# EAGLE design 副机 插座 v0.1 (EAGLE 6.3)
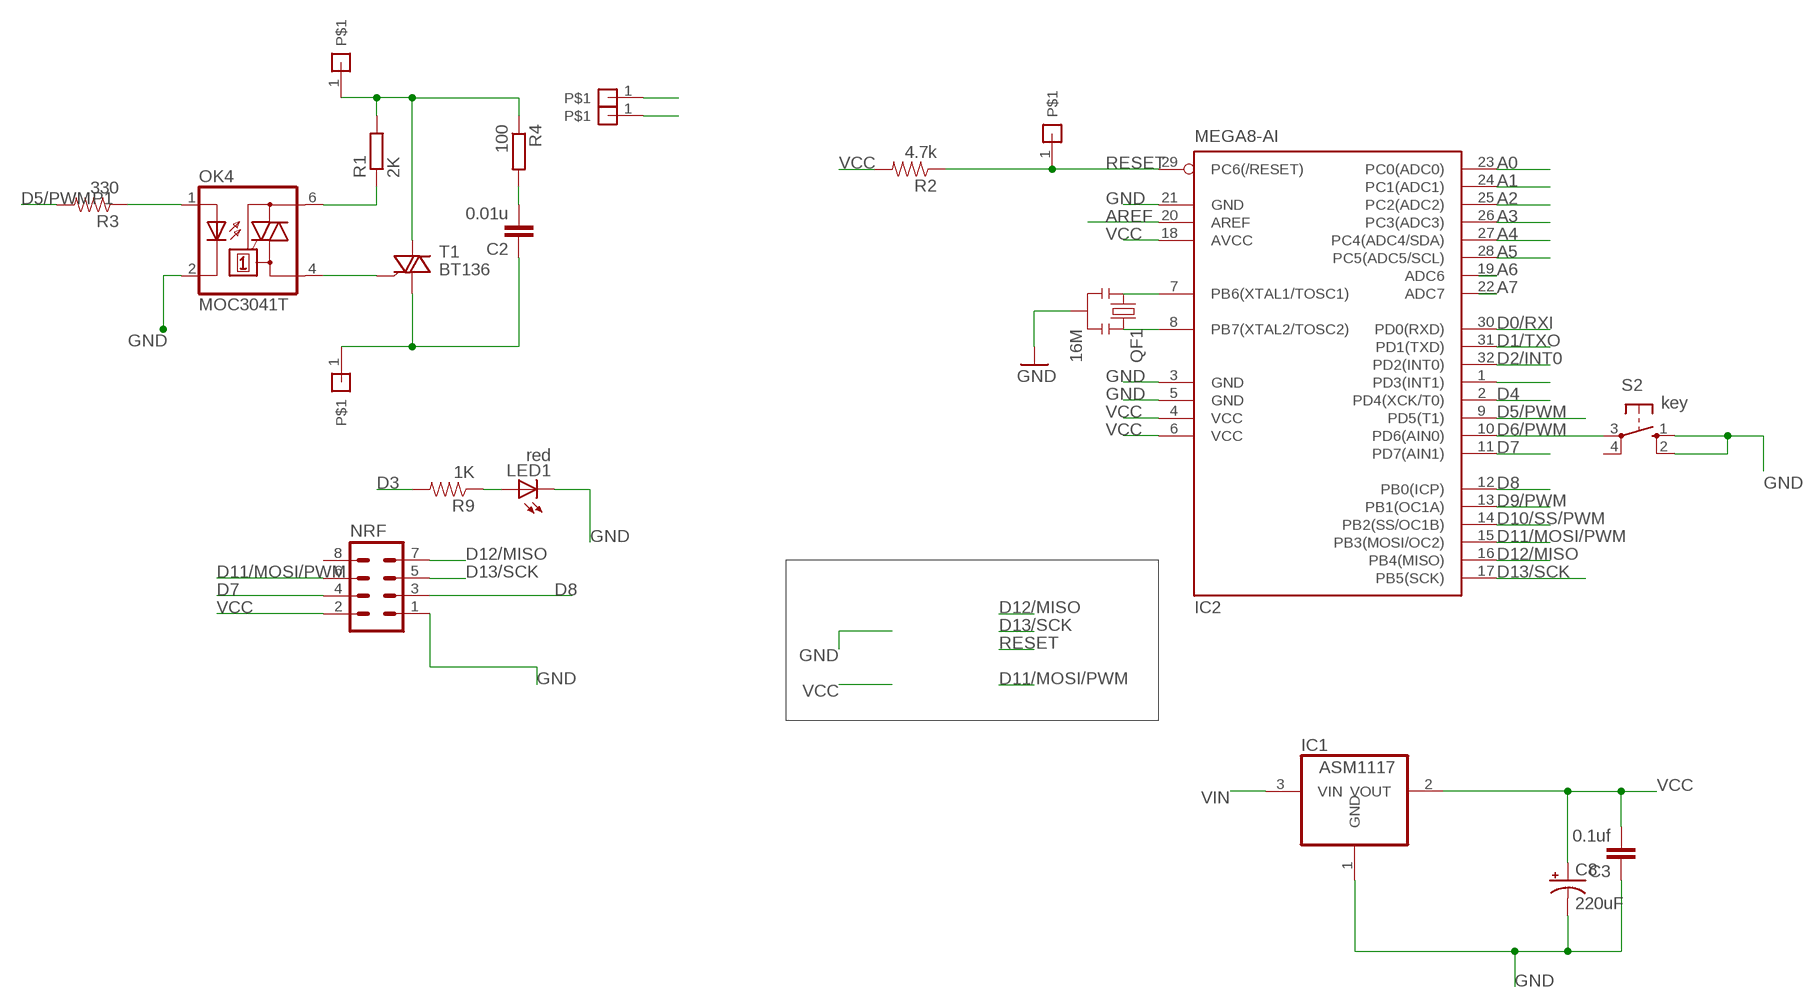
[diagram p0: schematic, sheet 1]

## Parts
C2  0.01u  C-EU050-024X044  [C050-024X044]
C3  0.1uf  CAP0603-CAP  [0603-CAP]
C8  220uF  CAP_POL3528  [EIA3528]
IC1  ASM1117  REG1117  [SOT223]
IC2  MEGA8-AI  [TQFP32-08]
LED1  red  LED3MM  [LED3MM]
NRF  MA04-2  [MA04-2]
OK4  MOC3041T  [DIL06B]
QF1  16M  RESONATORPTH  [RESONATOR-PTH]
R1  2K  R-EU_0204/7  [0204/7]
R2  4.7k  RESISTOR0603-RES  [0603-RES]
R3  330  RESISTOR0603-RES  [0603-RES]
R4  100  R-EU_0204/7  [0204/7]
R9  1K  RESISTOR0603-RES  [0603-RES]
S2  key  10-XX  [B3F-10XX]
T1  BT136  [TO220AB]
U$1  PIN1  [PIN1]
U$2  PIN1  [PIN1]
U$3  PIN1  [PIN1]
U$4  PIN1  [PIN1]
U$5  PIN1  [PIN1]

## Nets
A0: IC2.23(PC0(ADC0))
A1: IC2.24(PC1(ADC1))
A2: IC2.25(PC2(ADC2))
A3: IC2.26(PC3(ADC3))
A4: IC2.27(PC4(ADC4/SDA))
A5: IC2.28(PC5(ADC5/SCL))
A6: IC2.19(ADC6)
A7: IC2.22(ADC7)
AREF: IC2.20(AREF)
D0/RXI: IC2.30(PD0(RXD))
D1/TXO: IC2.31(PD1(TXD))
D2/INT0: IC2.32(PD2(INT0))
D3: IC2.1(PD3(INT1)) R9.2
D4: IC2.2(PD4(XCK/T0))
D5/PWM: IC2.9(PD5(T1)) R3.2
D6/PWM: IC2.10(PD6(AIN0)) S2.3(P)
D7: IC2.11(PD7(AIN1)) NRF.4
D8: IC2.12(PB0(ICP)) NRF.3
D9/PWM: IC2.13(PB1(OC1A))
D10/SS/PWM: IC2.14(PB2(SS/OC1B))
D11/MOSI/PWM: IC2.15(PB3(MOSI/OC2)) NRF.6
D12/MISO: IC2.16(PB4(MISO)) NRF.7
D13/SCK: IC2.17(PB5(SCK)) NRF.5
GND: C3.1 C8.C(-) IC1.1(GND) IC2.3(GND) IC2.5(GND) IC2.21(GND) LED1.K(C) NRF.1 OK4.2(C) QF1.2 S2.1(S) S2.2(S1) U$4.1
IN: R1.2 R4.1 T1.2(A2) U$2.1
N$1: OK4.6(A2) R1.1
N$2: OK4.4(A1) T1.3(G)
N$6: C2.2 R4.2
N$15: LED1.A R9.1
OUT: C2.1 T1.1(A1) U$1.1
P1: OK4.1(A) R3.1
PB6: IC2.7(PB6(XTAL1/TOSC1)) QF1.1
PB7: IC2.8(PB7(XTAL2/TOSC2)) QF1.3
RESET: IC2.29(PC6(/RESET)) R2.1 U$5.1
VCC: C3.2 C8.A(+) IC1.2(VOUT) IC2.4(VCC) IC2.6(VCC) IC2.18(AVCC) NRF.2 R2.2
VIN: IC1.3(VIN) U$3.1
Unconnected: NRF.8 S2.4(P1)

## Library data of the parts
C2 = resistor:C-EU: CAPACITOR, European symbol
C3 = MY:CAP: Capacitor Standard 0603 ceramic capacitor, and 0.1" leaded capacitor.
C8 = MY:CAP_POL: Capacitor Polarized These are standard SMD and PTH capacitors. Normally 10uF, 47uF, and 100uF in electrolytic and tantalum varieties. Always verify the external diameter of the through hole cap, it varies with capacity, voltage, and manufacturer. The EIA devices should be standard.
IC1 = burr-brown:REG1117: 800mA and 1A Low Dropout (LDO) Positive Regulator 1.8V, 2.5V, 2.85V, 3.3V, 5V, and Adj; MPN: REG1117; OC_FARNELL: 1097566; OC_NEWARK: 14P6981
IC2 = atmel:MEGA8: MICROCONTROLLER 8 Kbytes FLASH, 1 kbytes SRAM, 512 bytes EEPROM, USART, 6-channel 10 bit ADC, 2-channel 8 bit ADC Pin compatible with Atmega48, ATMega88, ATMega168 Source: avr.lbr; MPN: ATMEGA8-16AU; OC_FARNELL: 9171371; OC_NEWARK: 73M8863
LED1 = led:LED: LED OSRAM: - CHIPLED LG R971, LG N971, LY N971, LG Q971, LY Q971, LO R971, LY R971 LH N974, LH R974 LS Q976, LO Q976, LY Q976 LO Q996 - Hyper CHIPLED LW Q18S LB Q993, LB Q99A, LB R99A - SideLED LS A670, LO A670, LY A670, LG A670, LP A670 LB A673, LV A673, LT A673, LW A673 LH A674 LY A675 LS A676, LA A676, LO A676, LY A676, LW A676 LS A679, LY A679, LG A679 - Hyper Micro SIDELED® LS Y876, LA Y876, LO Y876, LY Y876 LT Y87S - SmartLED LW L88C, LW L88S LB L89C, LB L89S, LG L890 LS L89K, LO L89K, LY L89K LS L896, LA L896, LO L896, LY L896 - TOPLED LS T670, LO T670, LY T670, LG T670, LP T670 LSG T670, LSP T670, LSY T670, LOP T670, LYG T670 LG T671, LOG T671, LSG T671 LB T673, LV T673, LT T673, LW T673 LH T674 LS T676, LA T676, LO T676, LY T676, LB T676, LH T676, LSB T676, LW T676 LB T67C, LV T67C, LT T67C, LS T67K, LO T67K, LY T67K, LW E67C LS E67B, LA E67B, LO E67B, LY E67B, LB E67C, LV E67C, LT E67C LW T67C LS T679, LY T679, LG T679 LS T770, LO T770, LY T770, LG T770, LP T770 LB T773, LV T773, LT T773, LW T773 LH T774 LS E675, LA E675, LY E675, LS T675 LS T776, LA T776, LO T776, LY T776, LB T776 LHGB T686 LT T68C, LB T68C - Hyper Mini TOPLED® LB M676 - Mini TOPLED Santana® LG M470 LS M47K, LO M47K, LY M47K Source: http://www.osram.convergy.de LUXEON: - LUMILED® LXK2-PW12-R00, LXK2-PW12-S00, LXK2-PW14-U00, LXK2-PW14-V00 LXK2-PM12-R00, LXK2-PM12-S00, LXK2-PM14-U00 LXK2-PE12-Q00, LXK2-PE12-R00, LXK2-PE12-S00, LXK2-PE14-T00, LXK2-PE14-U00 LXK2-PB12-K00, LXK2-PB12-L00, LXK2-PB12-M00, LXK2-PB14-N00, LXK2-PB14-P00, LXK2-PB14-Q00 LXK2-PR12-L00, LXK2-PR12-M00, LXK2-PR14-Q00, LXK2-PR14-R00 LXK2-PD12-Q00, LXK2-PD12-R00, LXK2-PD12-S00 LXK2-PH12-R00, LXK2-PH12-S00 LXK2-PL12-P00, LXK2-PL12-Q00, LXK2-PL12-R00 Source: www.luxeon.com KINGBRIGHT: KA-3528ASYC Source: www.kingbright.com
NRF = con-lstb:MA04-2: PIN HEADER; OC_FARNELL: unknown; OC_NEWARK: unknown
OK4 = optocoupler:MOC30*: 6-Pin DIP Zero-Cross Optoisolators Triac Driver Output (250/400 Volt Peak) Source: http://www.fairchildsemi.com/ds/MO/MOC3043-M.pdf; OC_FARNELL: unknown; OC_NEWARK: unknown
QF1 = MY:RESONATOR: Resonator Small SMD resonator. This is the itty bitty 10/20MHz resonators with built in caps. CSTCE10M0G55 and CSTCE20M0V53. Footprint has been reviewed closely but hasn't been tested yet.
R1 R4 = resistor:R-EU_: RESISTOR, European symbol
R2 R3 R9 = MY:RESISTOR: Resistor Basic schematic elements and footprints for 0603, 1206, and PTH 1/10th watt (small) resistors.
S2 = switch-omron:10-XX: OMRON SWITCH; MPN: B3F-1000; OC_FARNELL: 176432; OC_NEWARK: 36M3542
T1 = triac:BT136: Triac BT136 series E sensitive gate Source: http://www.nxp.com/acrobat_download/datasheets/BT136_SERIES_E_2.pdf
U$1-U$5 = PKJ:PIN1

## Net classes
1 power: width 0.381 mm

## Board
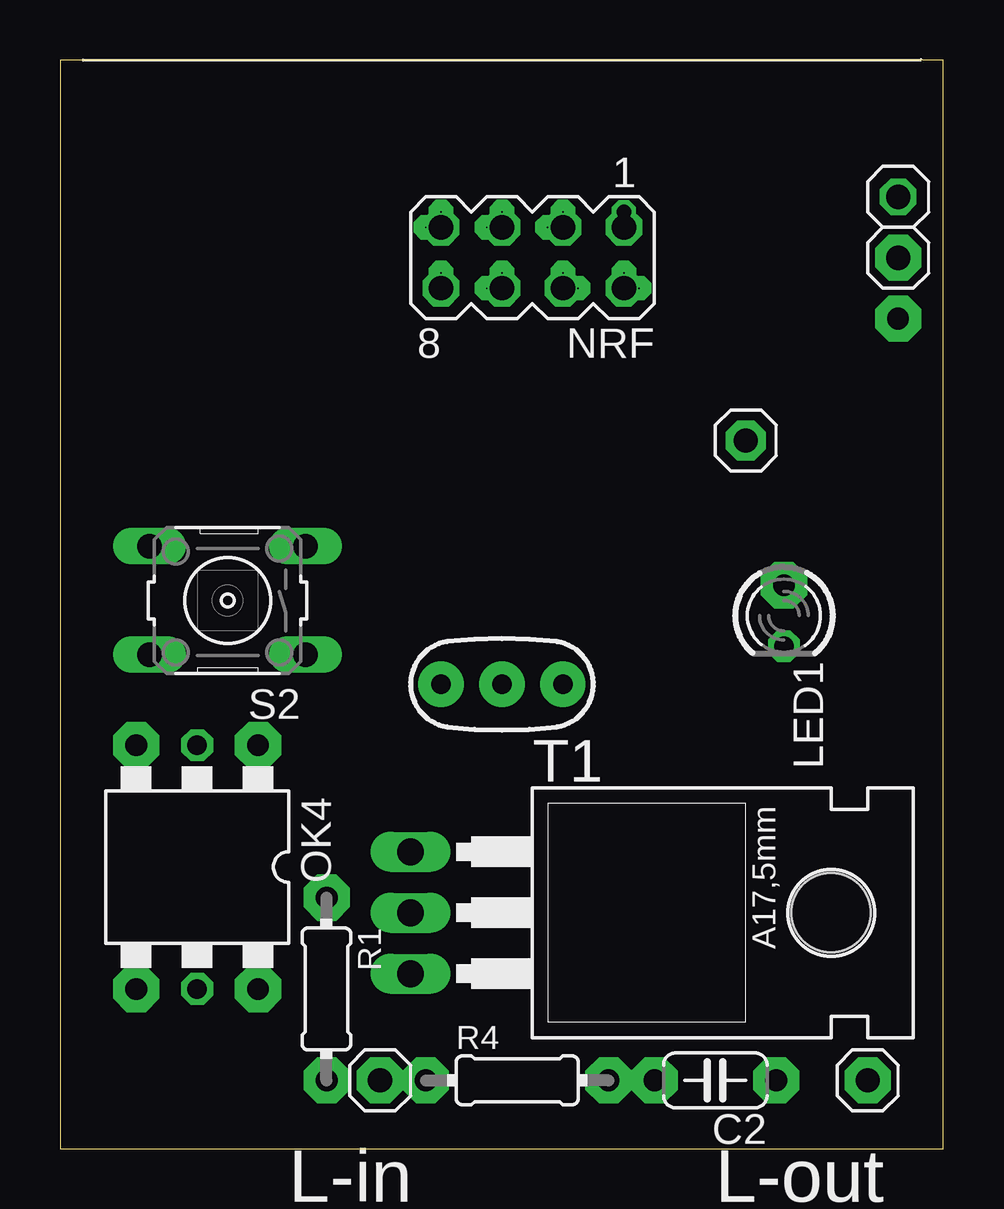
[diagram p1: board, top side]
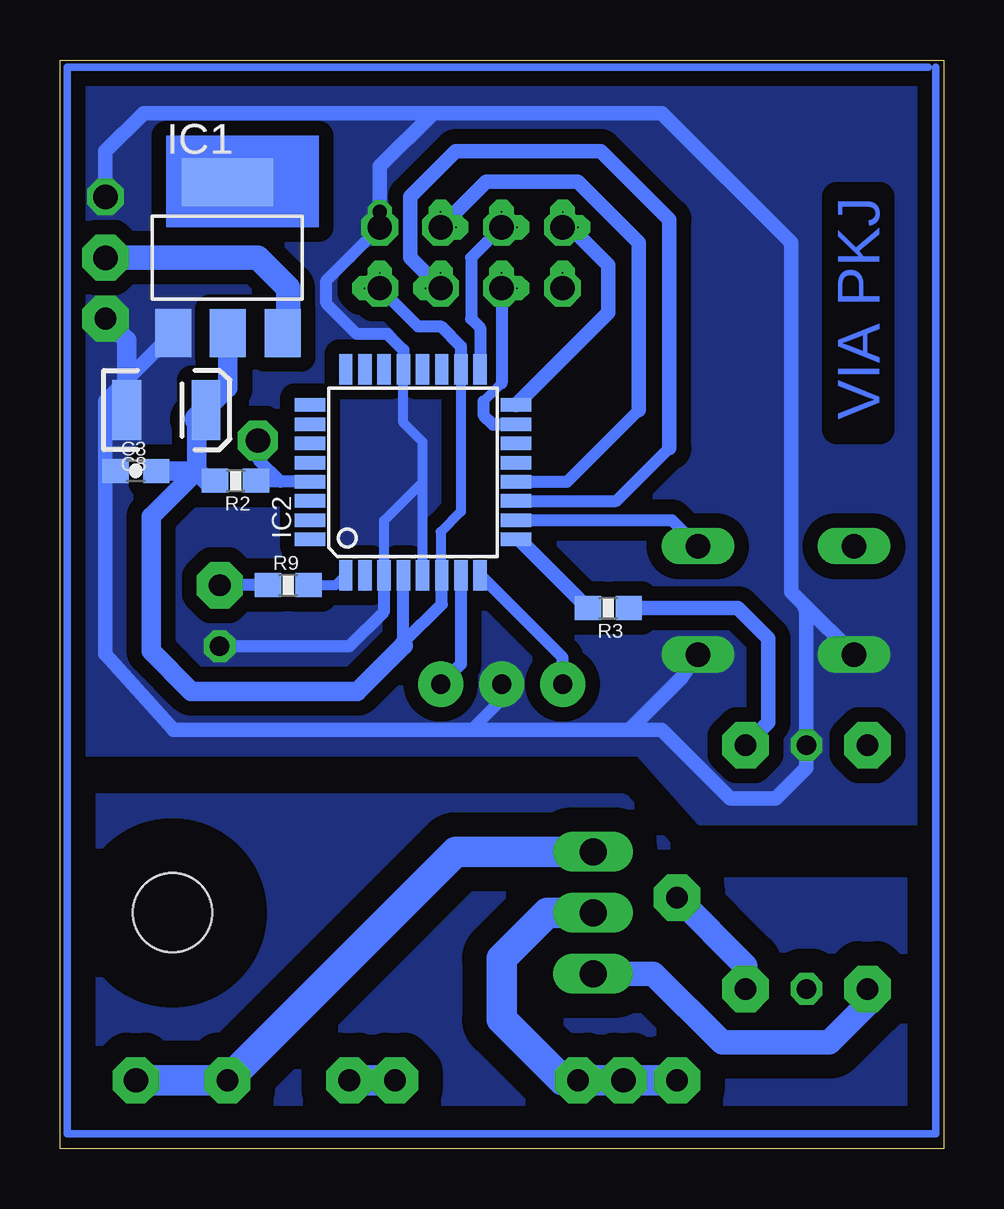
[diagram p2: board, bottom side, seen from below]

Size 36.81 x 45.39 mm. Coordinates in mm from the lower left corner, seen from the top.
Outline: 0,0 36.81,0 36.81,45.39 0,45.39 0,0
Copper layers (1*16): Top 0.035mm / dielectric 1.5mm / Bottom 0.035mm
Design rules "default": minimum track width 10mil, minimum drill 24mil, track to track 8mil, track to pad 8mil, pad to pad 8mil, via to via 8mil, smd to smd 8mil, copper to edge 40mil, drill to drill 8mil, minimum pad ring 10mil, minimum via ring 8mil, stop-mask expansion 4mil, vias tented up to drill 0mil, thermal gap 10mil

### Footprints (pad centres in the part's own frame; a part is rotated, then mirrored left to right if it is on the bottom)
C050-024X044 = drill 0.813 octagon: 1 -2.54,0; 2 2.54,0
0603-CAP = smd 1.1 x 1: 1 -0.85,0; 2 0.85,0
EIA3528 = smd 1.2 x 2.5: A 1.65,0; C -1.65,0
SOT223 = smd 1.499 x 2.007: 1 -2.261,-3.15; 2 0.025,-3.15; 3 2.311,-3.15 | smd 3.81 x 2.007: 4 0,3.15
TQFP32-08 = smd 1.27 x 0.559: 1 -4.293,2.8; 2 -4.293,2; 3 -4.293,1.2; 4 -4.293,0.4; 5 -4.293,-0.4; 6 -4.293,-1.2; 7 -4.293,-2; 8 -4.293,-2.8; 17 4.293,-2.8; 18 4.293,-2; 19 4.293,-1.2; 20 4.293,-0.4; 21 4.293,0.4; 22 4.293,1.2; 23 4.293,2; 24 4.293,2.8 | smd 0.559 x 1.27: 9 -2.8,-4.293; 10 -2,-4.293; 11 -1.2,-4.293; 12 -0.4,-4.293; 13 0.4,-4.293; 14 1.2,-4.293; 15 2,-4.293; 16 2.8,-4.293; 25 2.8,4.293; 26 2,4.293; 27 1.2,4.293; 28 0.4,4.293; 29 -0.4,4.293; 30 -1.2,4.293; 31 -2,4.293; 32 -2.8,4.293
LED3MM = drill 0.813 octagon: A -1.27,0; K 1.27,0
MA04-2 = drill 1.016 octagon: 1 -3.81,-1.27; 2 -3.81,1.27; 3 -1.27,-1.27; 4 -1.27,1.27; 5 1.27,-1.27; 6 1.27,1.27; 7 3.81,-1.27; 8 3.81,1.27
DIL06B = drill 0.813 octagon: 1 -2.54,-5.08; 2 0,-5.08; 3 2.54,-5.08; 4 2.54,5.08; 5 0,5.08; 6 -2.54,5.08
RESONATOR-PTH = drill 0.8 pad 1.88: 1 -2.54,0; 2 0,0; 3 2.54,0
0204/7 = drill 0.813 octagon: 1 -3.81,0; 2 3.81,0
0603-RES = smd 1.1 x 1: 1 -0.85,0; 2 0.85,0
B3F-10XX = drill 1.016 long: 1 -3.251,2.261; 2 3.251,2.261; 3 -3.251,-2.261; 4 3.251,-2.261
TO220AB = drill 1.118 long: 1 -2.54,-6.35; 2 0,-6.35; 3 2.54,-6.35 | hole 3.302: 0,11.176
PIN1 = drill 1.016 octagon: 1 0,0

### Placement (x,y rotation side)
C2  27.3,2.86 180 top
C3  33.66,28.26 0 bottom
C8  32.38,30.8 0 bottom
IC1  29.85,37.15 0 bottom
IC2  22.11,28.21 90 bottom
LED1  30.16,22.22 270 top
NRF  19.69,37.15 180 top
OK4  5.71,11.75 180 top
QF1  18.41,19.37 180 top
R1  11.1,6.67 270 top
R2  29.5,27.85 180 bottom
R3  13.97,22.54 180 bottom
R4  19.05,2.86 0 top
R9  27.3,23.49 0 bottom
S2  6.98,22.86 180 top
T1  20.96,9.84 270 top
U$1  33.66,2.86 0 top
U$2  13.34,2.86 0 top
U$3  34.92,37.15 0 top
U$4  34.92,39.69 0 top
U$5  28.57,29.53 0 top

### Tracks (layer width: path | path; a pad name or v marks a point on that pad's centre or on a via)
D3
  Bottom 0.406: R9.2 25.33,23.49 IC2.1
D5/PWM
  Bottom 0.406: IC2.9 17.68,25.41
  Bottom 0.61: 17.68,25.41 R3.2
D6/PWM
  Bottom 0.508: IC2.10 11.32,26.21 S2.3
D7
  Bottom 0.508: IC2.11 13.63,27.01 11.43,29.21
  Bottom 0.61: 11.43,29.21 11.43,38.74 14.29,41.59 20.32,41.59 22.23,39.69 22.23,37.15 NRF.4
D8
  Bottom 0.508: IC2.12 15.69,27.81 12.7,30.8
  Bottom 0.61: 12.7,30.8 12.7,37.78 15.24,40.32 19.05,40.32 NRF.3
D11/MOSI/PWM
  Bottom 0.406: 18.41,31.92 19.18,31.15 | 17.84,30.19 IC2.15 | 18.77,30.19 18.75,30.21
  Bottom 0.508: NRF.6 18.41,31.92 | 19.18,31.15 19.18,30.59 18.77,30.19 | 18.75,30.21 IC2.15
D12/MISO
  Bottom 0.61: IC2.16 13.97,34.85 13.97,36.83 15.56,38.42 NRF.7
D13/SCK
  Bottom 0.508: NRF.5 19.69,37.15 19.69,34.61 19.31,34.23 IC2.17
GND  (via drill 0.6, 0.9 pad 1.93)
  Bottom 0.406: IC2.5 21.71,27.8 | 21.71,27.8 21.71,29.47 22.51,30.27 IC2.21 | IC2.3 23.31,26.2 21.71,27.8 | C8.C 34.92,29.91 | C3.1 34.92,28.26
  Bottom 0.508: NRF.1 25.72,36.2 25.72,35.24 24.45,33.97 23.18,33.97 22.51,33.31 IC2.21 | LED1.K 24.77,20.95 23.31,22.41 IC2.3 | QF1.2 18.41,18.73 19.69,17.46
  Bottom 0.61: 21.27,43.18 23.5,40.96 v23.5,39.05 NRF.1 | 21.27,43.18 11.75,43.18 6.35,37.78 6.35,23.22 5.86,22.72 | S2.1 10.91,19.65 13.09,17.46 | U$4.1 34.92,41.59 33.34,43.18 21.27,43.18 | IC1.1 34.92,31.18 34.92,29.91 34.92,28.26 34.92,20.64 32.07,17.46 19.69,17.46 13.09,17.46 | S2.2 5.86,22.72 | 5.86,22.72 5.71,22.4 OK4.2 5.71,15.87 6.98,14.61 8.89,14.61 11.75,17.46 13.09,17.46
  Bottom 0.813: v34.92,34.61 34.03,33.72 C8.C
  pour Bottom (isolate 0.61, no thermals): 0.63,44.45 36.2,44.45 36.2,16.51 12.7,16.51 10.16,13.65 0.63,13.65
IN
  Bottom 0.813: 15.88,2.86 R4.1
  Bottom 1.27: T1.2 16.51,9.84 18.41,7.94 18.41,5.4 15.88,2.86 | R4.1 U$2.1 R1.2
N$1
  Bottom 1.016: OK4.6 8.25,7.63 R1.1
N$2
  Bottom 1.016: T1.3 12.09,7.3 9.23,4.44 4.76,4.44 3.17,6.03 OK4.4
N$3  (via drill 0.5 pad 1.68)
  other vias: 28.57,29.53
N$4  (via drill 0.9 pad 1.93)
  other vias: 3.17,16.83
N$5  (via drill 0.9 pad 1.93)
  other vias: 8.25,16.83
N$6
  Bottom 1.27: R4.2 C2.2
N$7  (via drill 0.9 pad 1.93)
  other vias: 3.17,6.67
N$8  (via drill 0.9 pad 1.93)
  other vias: 8.25,6.67
N$9  (via drill 0.9 pad 1.93)
  other vias: 11.11,2.86
N$10  (via drill 0.9 pad 1.93)
  other vias: 11.11,10.48
N$11  (via drill 0.9 pad 1.93)
  other vias: 24.77,2.86
N$12  (via drill 0.9 pad 1.93)
  other vias: 29.85,2.86
N$13  (via drill 0.9 pad 1.93)
  other vias: 33.66,2.86
N$14
  Bottom 0.305: 0.63,45.09 36.51,45.09 36.51,0.63 0.32,0.63 0.32,45.09
N$15
  Bottom 0.508: R9.1 LED1.A
N$16  (via drill 0.9 pad 1.93)
  other vias: 30.16,23.49
N$17  (via drill 0.9 pad 1.93)
  other vias: 15.24,2.86
N$18  (via drill 0.05 pad 1.02)
  other vias: 15.88,39.05
N$19  (via drill 0.9 pad 1.93)
  other vias: 13.34,2.86
N$20  (via drill 0.9 pad 1.93)
  other vias: 34.92,37.15
N$21  (via drill 0.06 pad 1.02)
  other vias: 15.88,36.51
N$22  (via drill 0.9 pad 1.93)
  other vias: 22.86,2.86
N$23  (via drill 0.06 pad 1.02)
  other vias: 18.41,36.51
N$24  (via drill 0.06 pad 1.02)
  other vias: 18.41,39.05
N$25  (via drill 0.06 pad 1.02)
  other vias: 20.96,39.05
N$26  (via drill 0.06 pad 1.02)
  other vias: 20.96,36.51
N$27  (via drill 0.06 pad 1.02)
  other vias: 23.5,36.51
N$28  (via drill 0.06 pad 1.02)
  other vias: 17.78,38.42
N$29  (via drill 0.06 pad 1.02)
  other vias: 20.32,38.42
N$30  (via drill 0.06 pad 1.02)
  other vias: 15.24,38.42
N$31  (via drill 0.06 pad 1.02)
  other vias: 17.78,35.88
N$32  (via drill 0.06 pad 1.02)
  other vias: 21.59,35.88
N$33  (via drill 0.06 pad 1.02)
  other vias: 24.13,35.88
OUT
  Bottom 1.27: T1.1 20.32,12.38 C2.1 U$1.1
P1
  Bottom 0.61: R3.1 8.57,22.54 7.3,21.27 7.3,17.78 OK4.1
PB6
  Bottom 0.508: IC2.7 20.11,20.21 QF1.1
PB7
  Bottom 0.508: QF1.3 15.88,20.48 IC2.8
RESET
  Bottom 0.508: IC2.29 27.62,27.81 | 27.62,27.81 28.65,27.81 R2.1 | U$5.1 28.57,28.76 27.62,27.81
VCC
  Bottom 0.406: IC2.18 20.11,26.56 20.96,25.72 20.96,23.96 IC2.6
  Bottom 0.508: IC2.6 20.91,22.7 22.51,21.1 | 22.51,21.1 IC2.4 | 22.51,21.1 22.51,20.99 | NRF.2 21.91,34.29 20.96,34.29 20.11,33.45 IC2.18
  Bottom 0.813: IC1.2 29.82,31.71 C8.A | 31.12,28.26 33.02,26.35 33.02,20.75 31.34,19.08 24.42,19.08 22.51,20.99 | C3.2 31.12,28.26 | 31.12,28.26 31.12,30.42 | R2.2 30.71,27.85 31.12,28.26
  Bottom 1.016: 31.12,30.42 C8.A
VIN
  Bottom 0.406: 27.3,34.23 IC1.3
  Bottom 1.016: U$3.1 28.57,37.15 27.3,35.88 27.3,34.23
X
  pour Bottom (isolate 1.016, no thermals): 36.2,14.61 36.2,0.63 0.63,0.63 0.63,11.11 10.16,11.11 13.34,14.61
(copper drawn outside any net)
  shapes: Bottom area x1

### Text on the board
Bottom: VIA PKJ
tPlace: L-in | L-out | L-out